# EAGLE design controller (EAGLE 7.7.0)
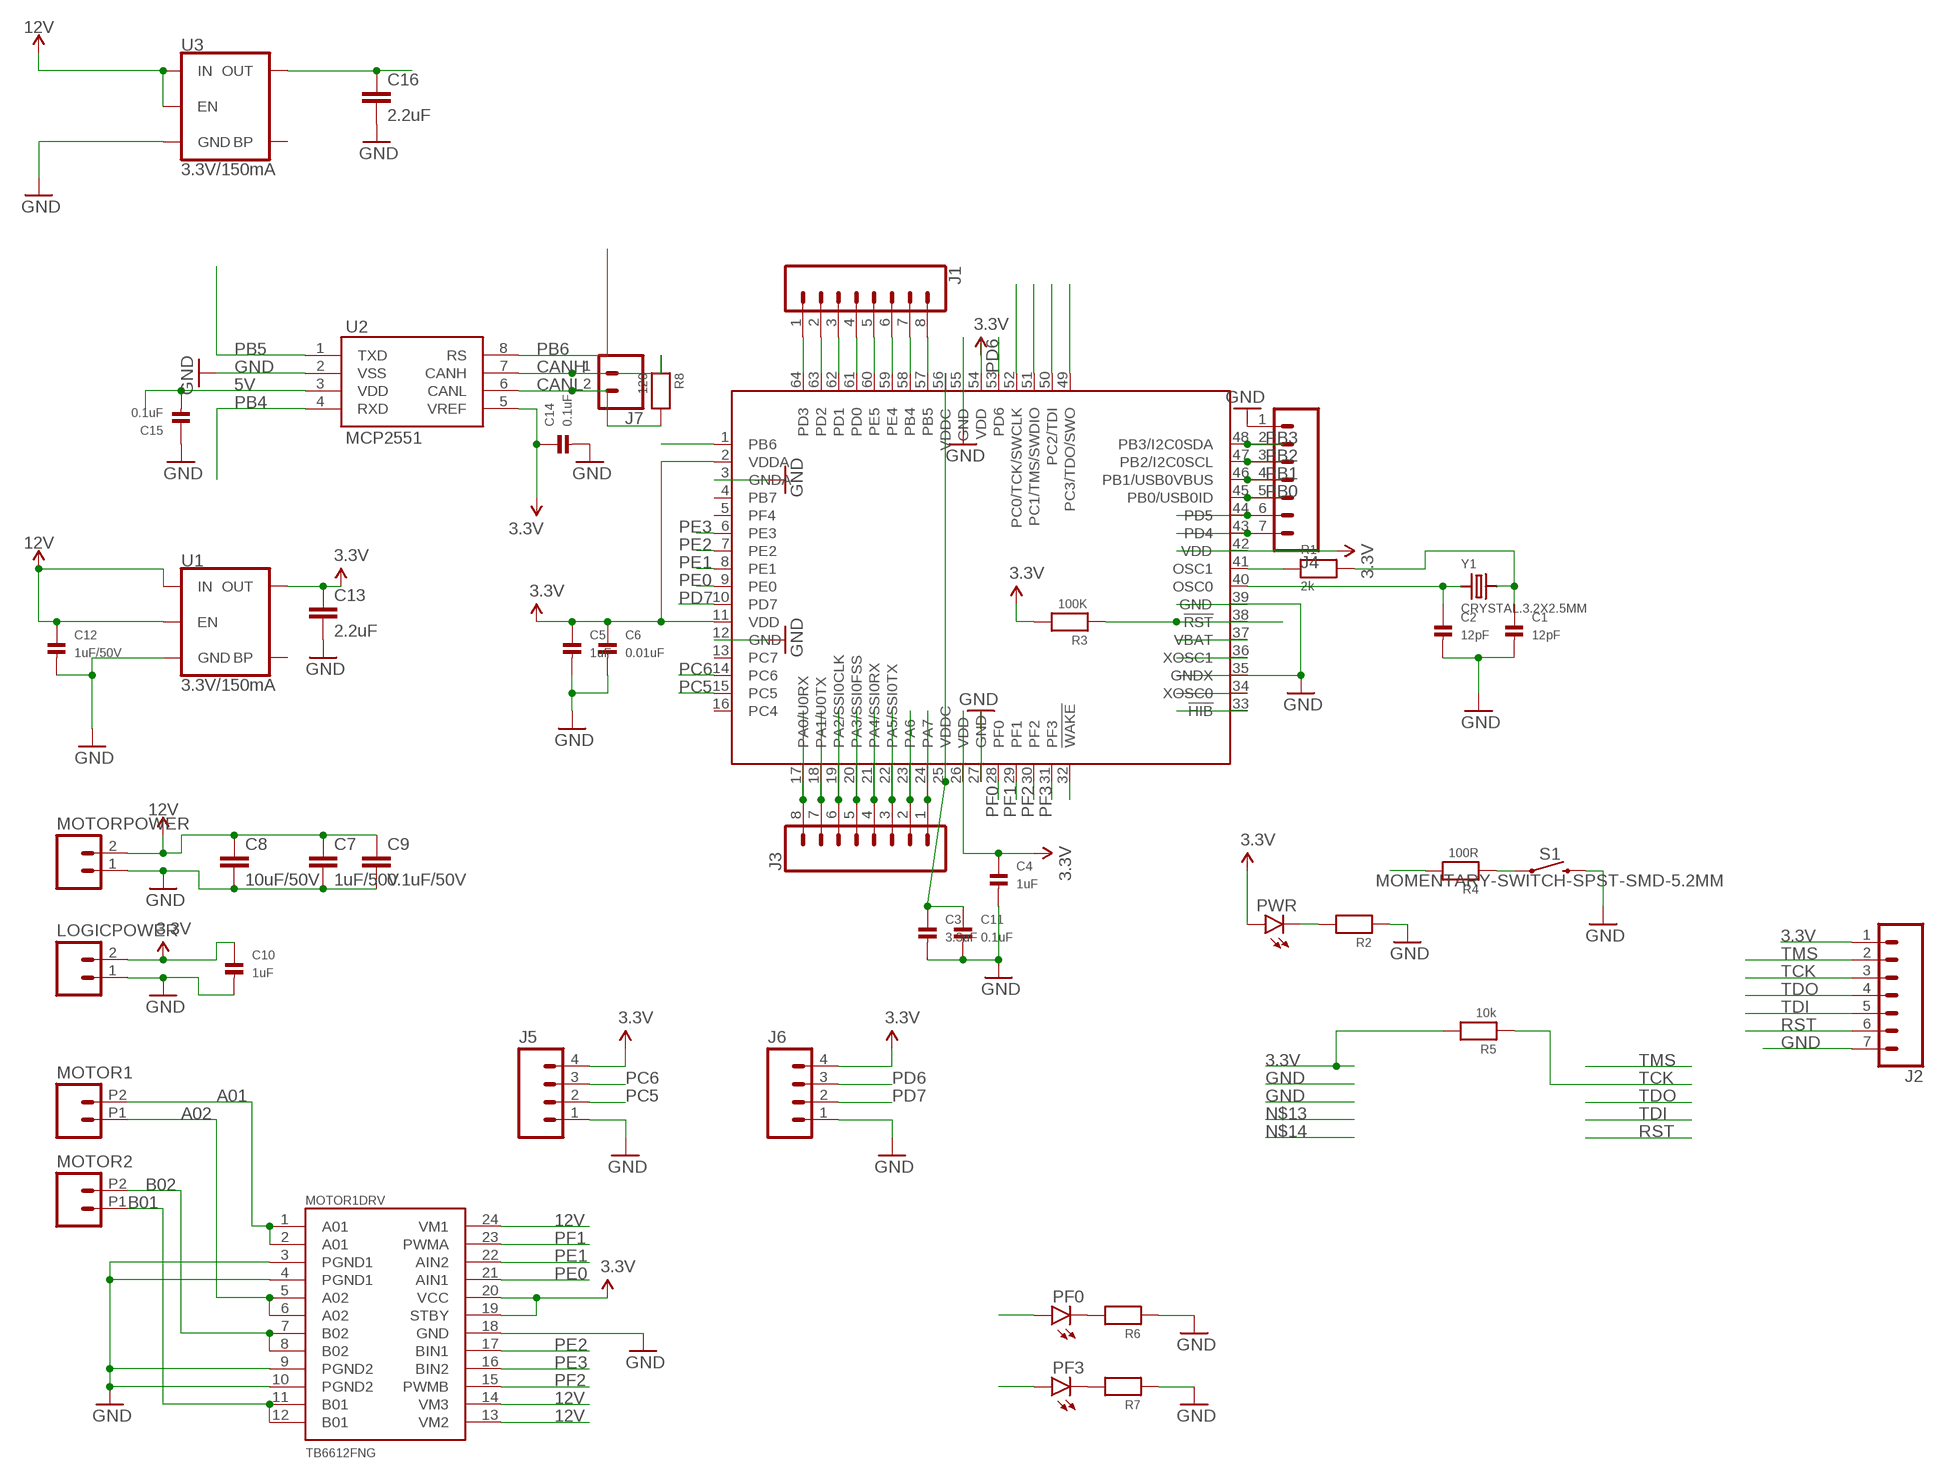
[diagram p0: schematic, sheet 1]

## Parts
C1  12pF  CAP_CERAMIC_0603MP  [_0603MP]
C2  12pF  CAP_CERAMIC_0603MP  [_0603MP]
C3  3.3uF  CAP_CERAMIC_0603MP  [_0603MP]
C4  1uF  CAP_CERAMIC_0603MP  [_0603MP]
C5  1uF  CAP_CERAMIC_0603MP  [_0603MP]
C6  0.01uF  CAP_CERAMIC_0603MP  [_0603MP]
C7  1uF/50V  0.1UF-25V(+80/-20%)(0603)  [0603-CAP]
C8  10uF/50V  1.0UF-25V-+80/-20(0805)"  [0805-CAP]
C9  0.1uF/50V  0.1UF-25V(+80/-20%)(0603)  [0603-CAP]
C10  1uF  CAP_CERAMIC_0603MP  [_0603MP]
C11  0.1uF  CAP_CERAMIC_0603MP  [_0603MP]
C12  1uF/50V  CAP_CERAMIC_0603MP  [_0603MP]
C13  2.2uF  2.2UF-0805-25V-(+80/-20%)  [0805]
C14  0.1uF  CAP_CERAMIC_0603MP  [_0603MP]
C15  0.1uF  CAP_CERAMIC_0603MP  [_0603MP]
C16  2.2uF  2.2UF-0805-25V-(+80/-20%)  [0805]
IC1  TM4C123[7,G]XXPM  [PM_S-PQFP-G64]
J1  CONN_08"  [1X08@1]
J2  CONN_07  [1X07@1]
J3  CONN_08"  [1X08@1]
J4  M07  [1X07]
J5  M04PTH  [1X04]
J6  M04PTH  [1X04]
J7  CONN_02  [1X02]
LOGICPOWER  M02PTH  [1X02@1]
MOTOR1  M022.54MM_SCREWTERM  [1X02_2.54_SCREWTERM@1]
MOTOR1DRV  TB6612FNG  [SSOP24]
MOTOR2  M022.54MM_SCREWTERM  [1X02_2.54_SCREWTERM@1]
MOTORPOWER  M02PTH  [1X02@1]
PF0  LED0603  [LED-0603]
PF3  LED0603  [LED-0603]
PWR  LED0603  [LED-0603]
R1  2k  RESISTOR_0603MP  [_0603MP]
R2  RESISTOR_0603MP  [_0603MP]
R3  100K  RESISTOR_0603MP  [_0603MP]
R4  100R  RESISTOR_0603MP  [_0603MP]
R5  10k  RESISTOR_0603MP  [_0603MP]
R6  RESISTOR_0603MP  [_0603MP]
R7  RESISTOR_0603MP  [_0603MP]
R8  120  RESISTOR_0603MP  [_0603MP]
S1  MOMENTARY-SWITCH-SPST-SMD-5.2MM  [TACTILE_SWITCH_SMD_5.2MM]
U1  3.3V/150mA  V_REG_MIC52053.3V  [SOT23-5]
U2  MCP2551  [SO08]
U3  3.3V/150mA  V_REG_MIC52053.3V  [SOT23-5]
Y1  CRYSTAL.3.2X2.5MM  [3.2X2.5MM]

## Nets
3.3V: C4.1 C5.1 C6.1 C10.1 C13.1 C14.1 IC1.2(VDDA) IC1.11(VDD) IC1.26(VDD) IC1.42(VDD) IC1.54(VDD) J2.1 J5.4 J6.4 LOGICPOWER.2 MOTOR1DRV.19(STBY) MOTOR1DRV.20(VCC) PWR.A R3.2 R5.2 U1.5(OUT) U2.5(VREF)
5V: C15.2 C16.1 U2.3(VDD) U3.5(OUT)
12V: C7.1 C8.1 C9.1 C12.1 MOTOR1DRV.13(VM2) MOTOR1DRV.14(VM3) MOTOR1DRV.24(VM1) MOTORPOWER.2 U1.1(IN) U1.3(EN) U3.1(IN) U3.3(EN)
A01: MOTOR1.P2 MOTOR1DRV.1(A01) MOTOR1DRV.2(A01)
A02: MOTOR1.P1 MOTOR1DRV.5(A02) MOTOR1DRV.6(A02)
B01: MOTOR1DRV.11(B01) MOTOR1DRV.12(B01) MOTOR2.P1
B02: MOTOR1DRV.7(B02) MOTOR1DRV.8(B02) MOTOR2.P2
CANH: J7.1 R8.1 U2.7(CANH)
CANL: J7.2 R8.2 U2.6(CANL)
GND: C1.2 C2.2 C3.2 C4.2 C5.2 C6.2 C7.2 C8.2 C9.2 C10.2 C11.2 C12.2 C13.2 C14.2 C15.1 C16.2 IC1.3(GNDA) IC1.12(GND) IC1.27(GND) IC1.35(GNDX) IC1.39(GND) IC1.55(GND) J2.7 J4.1 J5.1 J6.1 LOGICPOWER.1 MOTOR1DRV.3(PGND1) MOTOR1DRV.4(PGND1) MOTOR1DRV.9(PGND2) MOTOR1DRV.10(PGND2) MOTOR1DRV.18(GND) MOTORPOWER.1 R2.1 R6.1 R7.1 S1.3 U1.2(GND) U2.2(VSS) U3.2(GND)
N$1: IC1.41(OSC1) R1.1
N$2: C2.1 IC1.40(OSC0) Y1.1
N$3: C3.1 C11.1 IC1.25(VDDC) IC1.56(VDDC)
N$4: C1.1 R1.2 Y1.3
N$5: PF0.C R6.2
N$7: PF3.C R7.2
N$19: IC1.64(PD3) J1.1
N$20: IC1.63(PD2) J1.2
N$21: IC1.62(PD1) J1.3
N$22: IC1.61(PD0) J1.4
N$23: IC1.60(PE5) J1.5
N$24: IC1.59(PE4) J1.6
N$28: IC1.32(!WAKE)
N$33: IC1.24(PA7) J3.1
N$34: IC1.23(PA6) J3.2
N$35: IC1.22(PA5/SSI0TX) J3.3
N$36: IC1.21(PA4/SSI0RX) J3.4
N$37: IC1.20(PA3/SSI0FSS) J3.5
N$38: IC1.19(PA2/SSI0CLK) J3.6
N$39: IC1.18(PA1/U0TX) J3.7
N$40: IC1.17(PA0/U0RX) J3.8
N$45: IC1.44(PD5) J4.6
N$46: IC1.43(PD4) J4.7
N$47: IC1.37(VBAT)
N$48: IC1.36(XOSC1)
N$49: IC1.34(XOSC0)
N$50: IC1.33(!HIB)
N$51: PWR.C R2.2
N$52: R4.1 S1.1
PB0: IC1.45(PB0/USB0ID) J4.5
PB1: IC1.46(PB1/USB0VBUS) J4.4
PB2: IC1.47(PB2/I2C0SCL) J4.3
PB3: IC1.48(PB3/I2C0SDA) J4.2
PB4: IC1.58(PB4) J1.7 U2.4(RXD)
PB5: IC1.57(PB5) J1.8 U2.1(TXD)
PB6: IC1.1(PB6) U2.8(RS)
PC5: IC1.15(PC5) J5.2
PC6: IC1.14(PC6) J5.3
PD6: IC1.53(PD6) J6.3
PD7: IC1.10(PD7) J6.2
PE0: IC1.9(PE0) MOTOR1DRV.21(AIN1)
PE1: IC1.8(PE1) MOTOR1DRV.22(AIN2)
PE2: IC1.7(PE2) MOTOR1DRV.17(BIN1)
PE3: IC1.6(PE3) MOTOR1DRV.16(BIN2)
PF0: IC1.28(PF0) PF0.A
PF1: IC1.29(PF1) MOTOR1DRV.23(PWMA)
PF2: IC1.30(PF2) MOTOR1DRV.15(PWMB)
PF3: IC1.31(PF3) PF3.A
RST: IC1.38(!RST) J2.6 R3.1 R4.2
TCK: IC1.52(PC0/TCK/SWCLK) J2.3 R5.1
TDI: IC1.50(PC2/TDI) J2.5
TDO: IC1.49(PC3/TDO/SWO) J2.4
TMS: IC1.51(PC1/TMS/SWDIO) J2.2
Unconnected: IC1.4(PB7) IC1.5(PF4) IC1.13(PC7) IC1.16(PC4) U1.4(BP) U3.4(BP)

## Library data of the parts
C1-C6 C10-C12 C14 C15 = microbuilder:CAP_CERAMIC: Ceramic Capacitors 0402 - 0402 Surface Mount Capacitors 16pF 50V 5% [Digikey: 445-4899-2-ND] 18pF 50V 5% [Digikey: 490-1281-2-ND] 22pF 50V 5% [Digikey: 490-1283-2-ND] 68pF 50V 5% [Digikey: 490-1289-2-ND] 0.1uF 10V 10% [Digikey: 490-1318-2-ND] 1.0uF 6.3V 10% [Digikey: 490-1320-2-ND] 0603 - 0603 Surface Mount Capacitors 16 pF 50V 5% [Digikey: 445-5051-2-ND] 22 pF 50V [Digikey: PCC220ACVTR-ND] 33 pF 50V 5% [Digikey: 490-1415-1-ND] 56pF 50V 5% [Digikey: 490-1421-1-ND] 220pF 50V 5% [Digikey: 445-1285-1-ND] 680 pF 50V 2200 pF 50V 5% C0G [Digikey: 445-1297-1-ND] 5600 pF 100V 5% X7R [Digikey: 478-3711-1-ND] 0.1 µF 25V 10% [Digikey: PCC2277TR-ND] 0.22 µF 16V 10% X7R [Digikey: 445-1318-1-ND] 1.0 µF 25V 10% [Digikey: 445-5146-2-ND] 0603 - RF Specific 3pF 250V +/-0.1pF RF [Digikey: 712-1347-1-ND] 18 pF 250V 5% [Digikey: 478-3505-1-ND or 712-1322-1-ND] 56 pF 250V 5% C0G RF [Digikey: 490-4867-1-ND] 68 pF 250V RF [Digikey: 490-4868-1-ND] 0805 - 0805 Surface Mount Capacitors 220 pF 250V 2% RF Ceramic Capacitor [Digikey: 712-1398-1-ND] 1000 pF 50V 2% NP0 Ceramic Capacitor [Digikey: 478-3760-1-ND] 0.1 µF 25V 10% Ceramic Capacitor [Digikey: PCC1828TR-ND] 1.0 µF 16V 10% Ceramic Capacitor[Digikey: 490-1691-2-ND] 10.0 µF 10V 10% Ceramic Capacitor[Digikey: 709-1228-1-ND] 10.0 uF 16V 10% Ceramic Capacitor [Digikey: 478-5165-2-ND] 47 uF 6.3V 20% Ceramic Capacitor [Digikey: 587-1779-1-ND or 399-5506-1-ND] 1206 - 1206 Surface Mount Capacitors 47uF 10V 20% Ceramic Capacitor [Digikey: 490-5528-1-ND or 399-5508-1-ND or 445-6010-1-ND] 100uF 6.3V -20%, +80% Y5V Ceramic Capacitor (Digikey: 490-4512-1-ND, Mouser: 81-GRM31CF50J107ZE1L)
C7 C9 = SparkFun-Capacitors:0.1UF-25V(+80/-20%)(0603): CAP-00810 Ceramic Standard decoupling cap; PROD_ID: CAP-00810; VALUE: 0.1uF
C8 = SparkFun-Capacitors:1.0UF-25V-+80/-20(0805): CAP-11625; PROD_ID: CAP-11625; VALUE: 1.0uF
C13 C16 = SparkFun-Capacitors:2.2UF: 2.2µF ceramic capacitors A capacitor is a passive two-terminal electrical component used to store electrical energy temporarily in an electric field.; PROD_ID: CAP-11624
IC1 = ti-tiva:TM4C123[7,G]XX
J1 J3 = SparkFun-Connectors:CONN_08: Multi connection point. Often used as Generic Header-pin footprint for 0.1 inch spaced/style header connections On any of the 0.1 inch spaced packages, you can populate with these: Break Away Headers - Straight <https://www.sparkfun.com/products/116> (PRT-00116) Break Away Male Headers - Right Angle <https://www.sparkfun.com/products/553> (PRT-00553) Female Headers <https://www.sparkfun.com/products/115> (PRT-00115) Break Away Headers - Machine Pin <https://www.sparkfun.com/products/117> (PRT-00117) Break Away Female Headers - Swiss Machine Pin <https://www.sparkfun.com/products/743> (PRT-00743) Arduino Stackable Header - 8 Pin <https://www.sparkfun.com/products/9279> (PRT-09279) For SCREWTERMINALS and SPRING TERMINALS visit here: Screw Terimnals on SparkFun.com <https://www.sparkfun.com/search/results?term=Screw+Terminals> (5mm/3.5mm/2.54mm spacing) This device is also useful as a general connection point to wire up your design to another part of your project. Our various solder wires solder well into these plated through hole pads. Hook-Up Wire - Assortment (Stranded, 22 AWG) <https://www.sparkfun.com/products/11375> (PRT-11375) Hook-Up Wire - Assortment (Solid Core, 22 AWG) <https://www.sparkfun.com/products/11367> (PRT-11367) View the entire wire category on our website here <https://www.sparkfun.com/categories/141> Special notes: Molex polarized connector foot print use with SKU : PRT-08231 with associated crimp pins and housings. 1MM SMD Version SKU: PRT-10208 NOTES ON THE VARIANTS LOCK and LOCK_LONGPADS... This footprint was designed to help hold the alignment of a through-hole component (i.e. 6-pin header) while soldering it into place. You may notice that each hole has been shifted either up or down by 0.005 of an inch from it's more standard position (which is a perfectly straight line). This slight alteration caused the pins (the squares in the middle) to touch the edges of the holes. Because they are alternating, it causes a "brace" to hold the component in place. 0.005 has proven to be the perfect amount of "off-center" position when using our standard breakaway headers. Although looks a little odd when you look at the bare footprint, once you have a header in there, the alteration is very hard to notice. Also,if you push a header all the way into place, it is covered up entirely on the bottom side.; PROD_ID: CONN-08438
J2 = SparkFun-Connectors:CONN_07: Multi connection point. Often used as Generic Header-pin footprint for 0.1 inch spaced/style header connections On any of the 0.1 inch spaced packages, you can populate with these: Break Away Headers - Straight <https://www.sparkfun.com/products/116> (PRT-00116) Break Away Male Headers - Right Angle <https://www.sparkfun.com/products/553> (PRT-00553) Female Headers <https://www.sparkfun.com/products/115> (PRT-00115) Break Away Headers - Machine Pin <https://www.sparkfun.com/products/117> (PRT-00117) Break Away Female Headers - Swiss Machine Pin <https://www.sparkfun.com/products/743> (PRT-00743) For SCREWTERMINALS and SPRING TERMINALS visit here: Screw Terimnals on SparkFun.com <https://www.sparkfun.com/search/results?term=Screw+Terminals> (5mm/3.5mm/2.54mm spacing) This device is also useful as a general connection point to wire up your design to another part of your project. Our various solder wires solder well into these plated through hole pads. Hook-Up Wire - Assortment (Stranded, 22 AWG) <https://www.sparkfun.com/products/11375> (PRT-11375) Hook-Up Wire - Assortment (Solid Core, 22 AWG) <https://www.sparkfun.com/products/11367> (PRT-11367) View the entire wire category on our website here <https://www.sparkfun.com/categories/141> Special notes: Molex polarized connector foot print use with SKU : PRT-08231 with associated crimp pins and housings. 1MM SMD Version SKU: PRT-10208 NOTES ON THE VARIANTS LOCK and LOCK_LONGPADS... This footprint was designed to help hold the alignment of a through-hole component (i.e. 6-pin header) while soldering it into place. You may notice that each hole has been shifted either up or down by 0.005 of an inch from it's more standard position (which is a perfectly straight line). This slight alteration caused the pins (the squares in the middle) to touch the edges of the holes. Because they are alternating, it causes a "brace" to hold the component in place. 0.005 has proven to be the perfect amount of "off-center" position when using our standard breakaway headers. Although looks a little odd when you look at the bare footprint, once you have a header in there, the alteration is very hard to notice. Also,if you push a header all the way into place, it is covered up entirely on the bottom side.
J4 = SparkFun-Connectors:M07: Header 7 Standard 7-pin 0.1" header. Use with straight break away headers (SKU : PRT-00116), right angle break away headers (PRT-00553), swiss pins (PRT-00743), machine pins (PRT-00117), and female headers (PRT-00115). NOTES ON THE VARIANTS LOCK and LOCK_LONGPADS... This footprint was designed to help hold the alignment of a through-hole component (i.e. 7-pin header) while soldering it into place. You may notice that each hole has been shifted either up or down by 0.005 of an inch from it's more standard position (which is usually a perfectly straight line). This slight alteration caused the pins (the squares in the middle) to touch the edges of the holes. Because they are alternating, it causes a "brace" to hold the header in place. 0.005 has proven to be the perfect amount of "off-center" position when using our standard breakaway headers. Although looks a little odd when you look at the bare footprint, once you have a header in there, the alteration is very hard to notice. Also, if you push a header all the way into place, it is covered up entirely on the bottom side. This idea of altering the position of holes to aid alignment will be further integrated into the Sparkfun Library for other footprints. It can help hold any component with 3 or more connection pins.
J5 J6 = SparkFun-Connectors:M04: Header 4 Standard 4-pin 0.1" header. Use with straight break away headers (SKU : PRT-00116), right angle break away headers (PRT-00553), swiss pins (PRT-00743), machine pins (PRT-00117), and female headers (PRT-00115). Molex polarized connector foot print use with SKU : PRT-08231 with associated crimp pins and housings. 1MM SMD Version SKU: PRT-10208; PROD_ID: CONN-09696
J7 = SparkFun-Connectors:CONN_02: Multi connection point. Often used as Generic Header-pin footprint for 0.1 inch spaced/style header connections On any of the 0.1 inch spaced packages, you can populate with these: Break Away Headers - Straight <https://www.sparkfun.com/products/116> (PRT-00116) Break Away Male Headers - Right Angle <https://www.sparkfun.com/products/553> (PRT-00553) Female Headers <https://www.sparkfun.com/products/115> (PRT-00115) Break Away Headers - Machine Pin <https://www.sparkfun.com/products/117> (PRT-00117) Break Away Female Headers - Swiss Machine Pin <https://www.sparkfun.com/products/743> (PRT-00743) For SCREWTERMINALS and SPRING TERMINALS visit here: Screw Terimnals on SparkFun.com <https://www.sparkfun.com/search/results?term=Screw+Terminals> (5mm/3.5mm/2.54mm spacing) This device is also useful as a general connection point to wire up your design to another part of your project. Our various solder wires solder well into these plated through hole pads. Hook-Up Wire - Assortment (Stranded, 22 AWG) <https://www.sparkfun.com/products/11375> (PRT-11375) Hook-Up Wire - Assortment (Solid Core, 22 AWG) <https://www.sparkfun.com/products/11367> (PRT-11367) View the entire wire category on our website here <https://www.sparkfun.com/categories/141> Special notes: Molex polarized connector foot print use with: PRT-08233 with associated crimp pins and housings. 2.54_SCREWTERM for use with PRT-10571. 3.5mm Screw Terminal footprints for PRT-08084 5mm Screw Terminal footprints for use with PRT-08432
LOGICPOWER MOTOR1 MOTOR2 MOTORPOWER = SparkFun-Connectors:M02: Standard 2-pin 0.1" header. Use with - straight break away headers ( PRT-00116) - right angle break away headers (PRT-00553) - swiss pins (PRT-00743) - machine pins (PRT-00117) - female headers (PRT-00115) Molex polarized connector foot print use with: PRT-08233 with associated crimp pins and housings. 2.54_SCREWTERM for use with PRT-10571. 3.5mm Screw Terminal footprints for PRT-08084 5mm Screw Terminal footprints for use with PRT-08432
MOTOR1DRV = SparkFun-IC-Special-Function:TB6612FNG: Toshiba 1A dual motor driver IC-09363; PROD_ID: IC-09363
PF0 PF3 PWR = Ilya_Teach:LED: LEDs Standard schematic elements and footprints for 5mm, 3mm, 1206, and 0603 sized LEDs. 5mm - Spark Fun Electronics SKU : COM-00529 (and others)
R1-R8 = microbuilder:RESISTOR: Resistors 0402 - 0402 Surface Mount Package 22 Ohm 1% 1/16W [Digikey: 311-22.0LRTR-ND] 33 Ohm 5% 1/16W 1.0K 5% 1/16W 1.5K 5% 1/16W 2.0K 1% 1/16W 10.0K 1% 1/16W [Digikey: 311-10.0KLRTR-ND] 10.0K 5% 1/16W [Digikey: RMCF0402JT10K0TR-ND] 12.1K 1% 1/16W [Digikey: 311-22.0LRTR-ND] 100.0K 5% 1/16W 0603 - 0603 Surface Mount Package 0 Ohm 1/10 Watt 1% Resistor 15 Ohm 1/10 Watt 1% Resistor 33 Ohm 1/10 Watt 1% Resistor 49.9 Ohm 1/10 Watt 1% Resistor 100 Ohm 1/10 Watt 1% Resistor 150 Ohm 1/10 Watt 1% Resistor 240 Ohm 1/10 Watt 1% Resistor 390 Ohm 1/10 Watt 1% Resistor 560 Ohm 1/10 Watt 1% Resistor 680 Ohm 1/10 Watt 1% Resistor 750 Ohm 1/10 Watt 1% Resistor 1.0K Ohm 1/10 Watt 1% Resistor 1.5K Ohm 1/10 Watt 1% Resistor 2.0K Ohm 1/10 Watt 1% Resistor 2.2K Ohm 1/10 Watt 1% Resistor 3.3K Ohm 1/10 Watt 1% Resistor 4.7K Ohm 1/10 Watt 1% Resistor 10.0K Ohm 1/10 Watt 1% Resistor 12.0K Ohm 1/10 Watt 1% Resistor 12.1K Ohm 1/10 Watt 1% Resistor 20.0K Ohm 1/10 Watt 1% Resistor 33.0K Ohm 1/10 Watt 1% Resistor 100.0K Ohm 1/10 Watt 1% Resistor 0805 - 0805 Surface Mount Package 0 Ohm 1/8 Watt 1% Resistor 33 Ohm 1/8 Watt 1% Resistor 100 Ohm 1/8 Watt 1% Resistor 150 Ohm 1/8 Watt 1% Resistor 200 Ohm 1/8 Watt 1% Resistor 240 Ohm 1/8 Watt 1% Resistor 330 Ohm 1/8 Watt 1% Resistor 390 Ohm 1/8 Watt 1% Resistor 470 Ohm 1/8 Watt 1% Resistor 1.0K Ohm 1/8 Watt 1% Resistor 1.5K Ohm 1/8 Watt 1% Resistor 2.0K Ohm 1/8 Watt 1% Resistor 4.7K Ohm 1/8 Watt 1% Resistor 5.1K Ohm 1/8 Watt 1% Resistor 5.6K Ohm 1/8 Watt 1% Resistor 10.0K Ohm 1/8 Watt 1% Resistor 22.0K Ohm 1/8 Watt 1% Resistor 33.0K Ohm 1/8 Watt 1% Resistor 100K Ohm 1/8 Watt 1% Resistor 1206 - 1206 Surface Mount Package 2012 - 2010 Surface Mount Package 0.11 Ohm 1/2 Watt 1% Resistor - Digikey: RHM.11UCT-ND
S1 = SparkFun-Switches:MOMENTARY-SWITCH-SPST: Momentary Switch (Pushbutton) - SPST Normally-open (NO) SPST momentary switches (buttons, pushbuttons). Variants PTH-12MM - 12mm square, through-hole Momentary Pushbutton Switch - 12mm Square <https://www.sparkfun.com/products/9190> (COM-09190) PTH-6.0MM, PTH-6.0MM-KIT - 6.0mm square, through-hole Mini Pushbutton Switch <https://www.sparkfun.com/products/97> (COM-00097) KIT package intended for soldering kit's - only one side of pads' copper is exposed. PTH-RIGHT-ANGLE-KIT - Right-angle, through-hole Right Angle Tactile Button <https://www.sparkfun.com/products/10791> - Used on SparkFun BigTime Watch Kit <https://www.sparkfun.com/products/11734> SMD-12MM - 12mm square, surface-mount Tactile Button - SMD (12mm) <https://www.sparkfun.com/products/12993> (COM-12993) Used on SparkFun PicoBoard <https://www.sparkfun.com/products/11888> SMD-4.5MM - 4.5mm Square Trackball Switch Used on SparkFun Blackberry Trackballer Breakout <https://www.sparkfun.com/products/13169> SMD-4.6MMX2.8MM - 4.60mm x 2.80mm, surface mount Used on SparkFun SAMD21 Mini Breakout <https://www.sparkfun.com/products/13664> SMD-5.2MM, SMD-5.2-REDUNDANT - 5.2mm square, surface-mount Mini Pushbutton Switch - SMD <https://www.sparkfun.com/products/8720> (COM-08720) Used on Arduino Pro Mini <https://www.sparkfun.com/products/11114> REDUNDANT package connects both switch circuits together SMD-6.0X3.5MM - 6.0 x 3.5mm, surface mount Momentary Reset Switch SMD <https://www.sparkfun.com/products/8229> (COM-08229) SMD-6.2MM-TALL - 6.2mm square, surface mount Tactile Button - SMD (6mm) <https://www.sparkfun.com/products/12992> Used on SparkFun Digital Sandbox <https://www.sparkfun.com/products/12651> SMD-RIGHT-ANGLE - Right-angle, surface mount Used on SparkFun Block for Intel® Edison - Arduino <https://www.sparkfun.com/products/13036>; PROD_ID: SWCH-08247; SF_SKU: COM-08720
U1 U3 = SparkFun-IC-Power:V_REG_MIC5205: V_REG MIC5205 Standard 3.3V, 5V, and Adjustable 150mA LDO voltage regulator in SOT-23 layout. Micrel part MIC5205. BP (by-pass) pin is used to lower output noise with 470pF cap, may be left open. On the adjustable version BP is used to set output.; PROD_ID: VREG-00822
U2 = SparkFun-IC-Comms:MCP2551: MCP2551 High Speed CAN Transceiver High speed CAN transceiver Datasheet <http://www.sparkfun.com/datasheets/DevTools/Arduino/MCP2551.pdf> SparkFun Products CAN-BUS Shield <https://www.sparkfun.com/products/13262> (DEV-13262) SparkFun OBD-II UART <https://www.sparkfun.com/products/9555> (WIG-09555); PROD_ID: IC-09907
Y1 = genLib:CRYSTAL

## Board
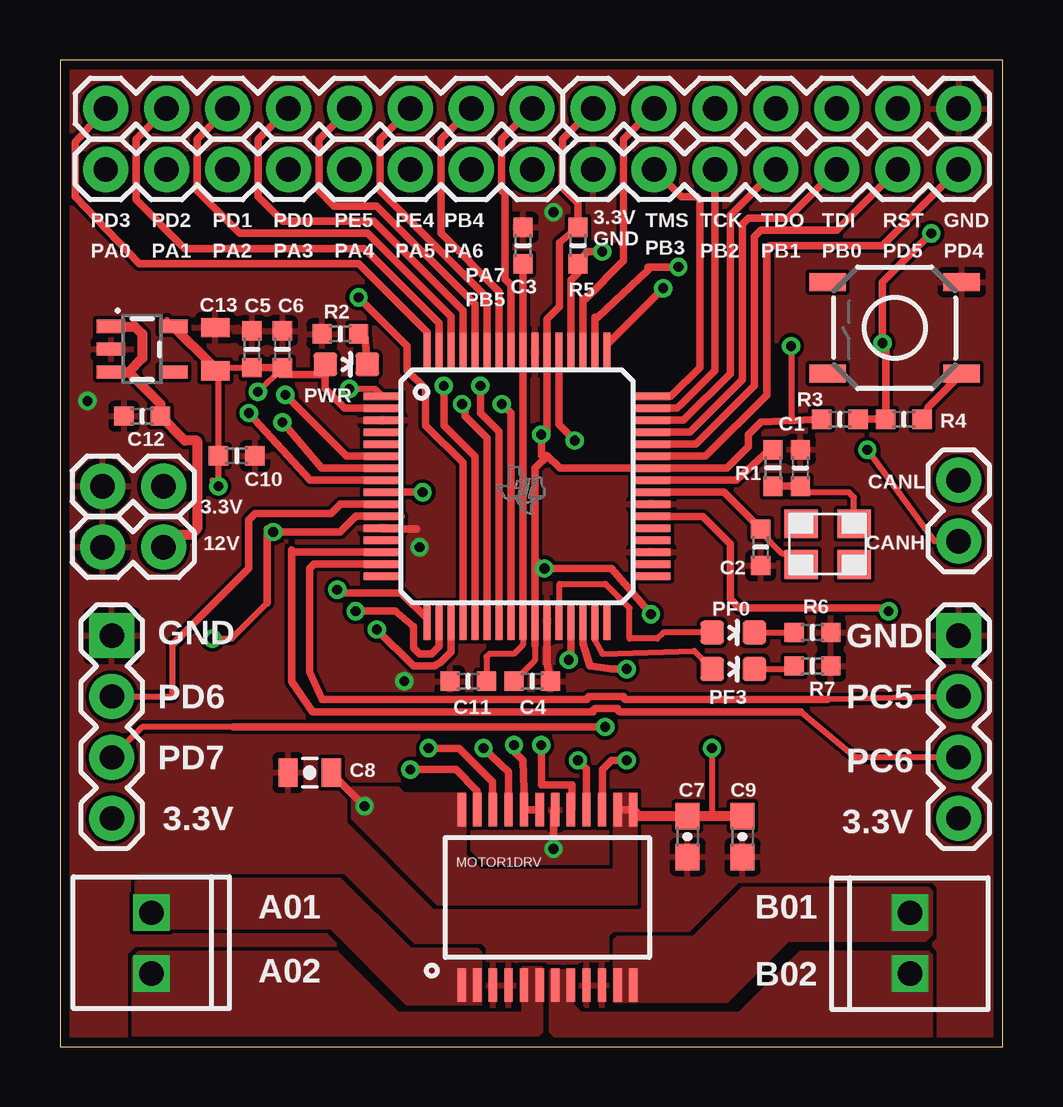
[diagram p1: board, top side]
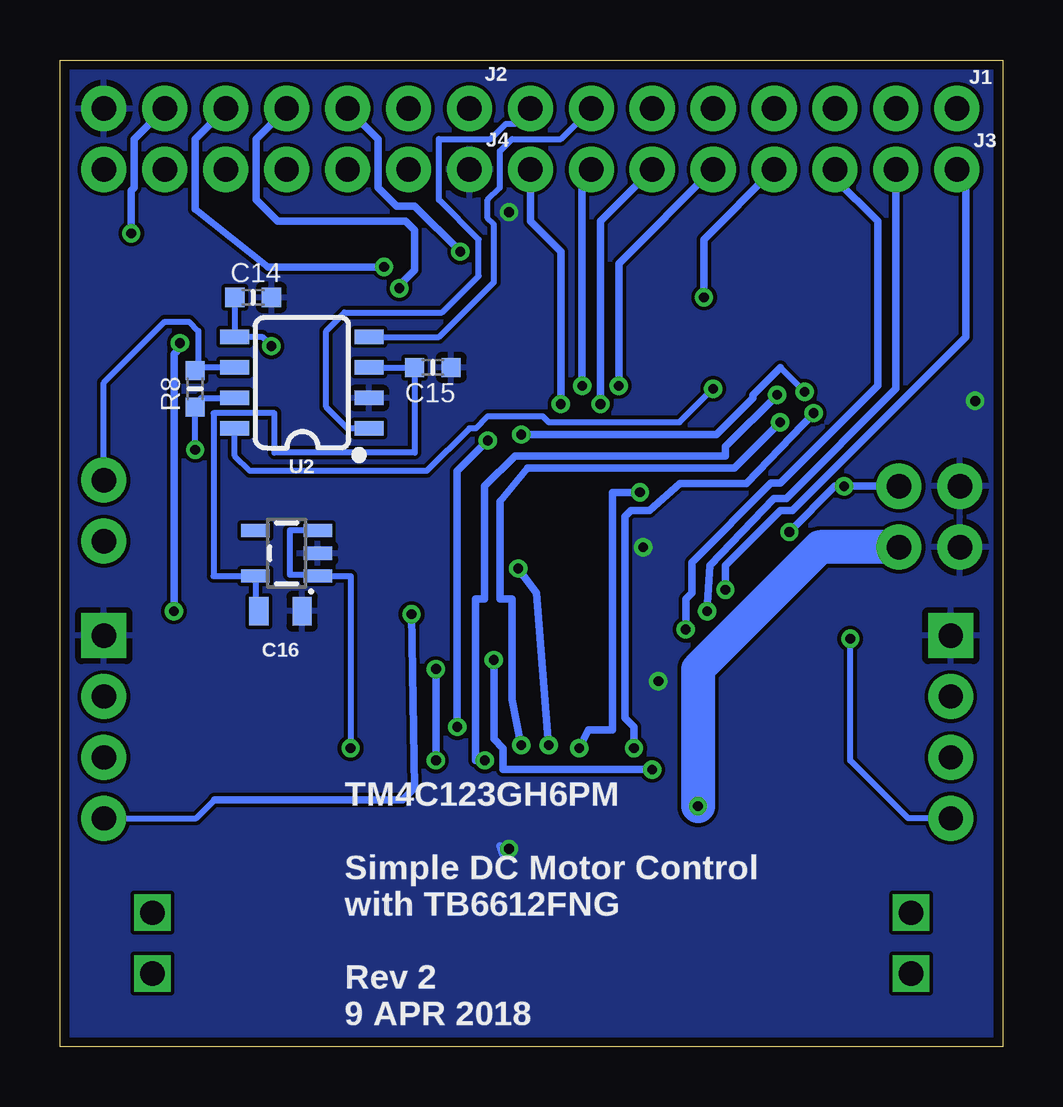
[diagram p2: board, bottom side, seen from below]

Size 39.29 x 41.14 mm. Coordinates in mm from the lower left corner, seen from the top.
Outline: 0,0 39.29,0 39.29,41.14 0,41.14 0,0
Copper layers (1*16): Top 0.0356mm / dielectric 1.5011mm / Bottom 0.0356mm
Design rules "LaenPCBOrder *": minimum track width 6mil, minimum drill 13mil, track to track 6mil, track to pad 6mil, pad to pad 6mil, via to via 6mil, smd to smd 6mil, copper to edge 15mil, drill to drill 6mil, minimum pad ring 7mil, minimum via ring 7mil, stop-mask expansion 3mil, vias tented up to drill 30mil, thermal gap 10mil

### Footprints (pad centres in the part's own frame; a part is rotated, then mirrored left to right if it is on the bottom)
_0603MP = smd 0.8 x 0.8: 1 -0.762,0; 2 0.762,0
0603-CAP = smd 1.1 x 1: 1 -0.85,0; 2 0.85,0
0805-CAP = smd 0.8 x 1.2: 1 -0.9,0; 2 0.9,0
0805 = smd 0.8 x 1.2: 1 -0.9,0; 2 0.9,0
PM_S-PQFP-G64 = smd 1.6 x 0.3: 1 -5.6,3.75; 2 -5.6,3.25; 3 -5.6,2.75; 4 -5.6,2.25; 5 -5.6,1.75; 6 -5.6,1.25; 7 -5.6,0.75; 8 -5.6,0.25; 9 -5.6,-0.25; 10 -5.6,-0.75; 11 -5.6,-1.25; 12 -5.6,-1.75; 13 -5.6,-2.25; 14 -5.6,-2.75; 15 -5.6,-3.25; 16 -5.6,-3.75; 33 5.6,-3.75; 34 5.6,-3.25; 35 5.6,-2.75; 36 5.6,-2.25; 37 5.6,-1.75; 38 5.6,-1.25; 39 5.6,-0.75; 40 5.6,-0.25; 41 5.6,0.25; 42 5.6,0.75; 43 5.6,1.25; 44 5.6,1.75; 45 5.6,2.25; 46 5.6,2.75; 47 5.6,3.25; 48 5.6,3.75 | smd 0.3 x 1.6: 17 -3.75,-5.6; 18 -3.25,-5.6; 19 -2.75,-5.6; 20 -2.25,-5.6; 21 -1.75,-5.6; 22 -1.25,-5.6; 23 -0.75,-5.6; 24 -0.25,-5.6; 25 0.25,-5.6; 26 0.75,-5.6; 27 1.25,-5.6; 28 1.75,-5.6; 29 2.25,-5.6; 30 2.75,-5.6; 31 3.25,-5.6; 32 3.75,-5.6; 49 3.75,5.6; 50 3.25,5.6; 51 2.75,5.6; 52 2.25,5.6; 53 1.75,5.6; 54 1.25,5.6; 55 0.75,5.6; 56 0.25,5.6; 57 -0.25,5.6; 58 -0.75,5.6; 59 -1.25,5.6; 60 -1.75,5.6; 61 -2.25,5.6; 62 -2.75,5.6; 63 -3.25,5.6; 64 -3.75,5.6
1X08@1 = drill 1.016 pad 1.88: 1 0,0; 2 2.54,0; 3 5.08,0; 4 7.62,0; 5 10.16,0; 6 12.7,0; 7 15.24,0; 8 17.78,0
1X07@1 = drill 1.016 pad 1.88: 1 0,0; 2 2.54,0; 3 5.08,0; 4 7.62,0; 5 10.16,0; 6 12.7,0; 7 15.24,0
1X07 = drill 1.016 pad 1.88: 1 0,0; 2 2.54,0; 3 5.08,0; 4 7.62,0; 5 10.16,0; 6 12.7,0; 7 15.24,0
1X04 = drill 1.016 pad 1.88 square: 1 0,0 | drill 1.016 pad 1.88: 2 2.54,0; 3 5.08,0; 4 7.62,0
1X02 = drill 1.016 pad 1.88: 1 0,0; 2 2.54,0
1X02@1 = drill 1.016 pad 1.88: 1 0,0; 2 2.54,0
1X02_2.54_SCREWTERM@1 = drill 1.016 square: P1 2.54,0; P2 0,0
SSOP24 = smd 0.348 x 1.397: 1 -3.575,-3.656; 2 -2.925,-3.656; 3 -2.275,-3.656; 4 -1.625,-3.656; 5 -0.975,-3.656; 6 -0.325,-3.656; 7 0.325,-3.656; 8 0.975,-3.656; 9 1.625,-3.656; 10 2.275,-3.656; 11 2.925,-3.656; 12 3.575,-3.656; 13 3.575,3.656; 14 2.925,3.656; 15 2.275,3.656; 16 1.625,3.656; 17 0.975,3.656; 18 0.325,3.656; 19 -0.325,3.656; 20 -0.975,3.656; 21 -1.625,3.656; 22 -2.275,3.656; 23 -2.925,3.656; 24 -3.575,3.656
LED-0603 = smd 1 x 1: A 0,-0.877; C 0,0.877
TACTILE_SWITCH_SMD_5.2MM = smd 1.524 x 0.762: 1 -2.794,1.905; 2 2.794,1.905; 3 -2.794,-1.905; 4 2.794,-1.905
SOT23-5 = smd 0.55 x 1.2: 1 -0.95,-1.3; 2 0,-1.3; 3 0.95,-1.3; 4 0.95,1.3; 5 -0.95,1.3
SO08 = smd 0.6 x 1.2: 1 -1.905,-2.8; 2 -0.635,-2.8; 3 0.635,-2.8; 4 1.905,-2.8; 5 1.905,2.8; 6 0.635,2.8; 7 -0.635,2.8; 8 -1.905,2.8
3.2X2.5MM = smd 1.4 x 1.2: 1 -1.1,-0.85; 2 1.1,-0.85; 3 1.1,0.85; 4 -1.1,0.85

### Placement (x,y rotation side)
C1  30.86,24.13 90 top
C2  29.21,20.83 270 top
C3  19.3,33.4 90 top
C4  19.69,15.24 0 top
C5  8,29.08 90 top
C6  9.27,29.08 90 top
C7  26.16,8.76 270 top
C8  10.41,11.43 180 top
C9  28.45,8.76 270 top
C10  7.37,24.64 0 top
C11  17.02,15.24 180 top
C12  3.43,26.29 180 top
C13  6.48,29.08 90 top
C14  31.24,31.24 0 bottom
C15  23.75,28.32 180 bottom
C16  30.1,18.16 0 bottom
IC1  19.05,23.37 0 top
J1  1.91,39.12 0 top
J2  22.23,39.12 0 top
J3  19.69,36.58 180 top
J4  22.23,36.58 0 top
J5  37.47,17.14 270 top
J6  2.16,17.14 270 top
J7  37.47,21.08 90 top
LOGICPOWER  1.78,23.37 0 top
MOTOR1  3.81,5.59 270 top
MOTOR1DRV  20.32,6.22 0 top
MOTOR2  35.43,3.05 90 top
MOTORPOWER  1.78,20.83 0 top
PF0  28.07,17.27 270 top
PF3  28.07,15.75 270 top
PWR  11.94,28.45 270 top
R1  29.72,24.13 270 top
R2  11.68,29.72 0 top
R3  32.51,26.16 180 top
R4  35.18,26.16 180 top
R5  21.59,33.4 90 top
R6  31.37,17.27 180 top
R7  31.37,15.88 180 top
R8  33.66,27.43 90 bottom
S1  34.8,29.97 180 top
U1  3.43,29.08 270 top
U2  29.21,27.69 90 bottom
U3  29.84,20.57 90 bottom
Y1  32,20.96 0 top

### Tracks (layer width: path | path; a pad name or v marks a point on that pad's centre or on a via)
3.3V  (via drill 0.41)
  Top 0.254: v6.35,17.02 7.16,17.02 8.64,18.49 | 19.8,16.75 19.8,16.12 C4.1 | C6.1 v8.25,27.3 | 6.35,23.62 v6.6,23.37 C10.1 6.6,28.19 | 8.13,28.19 C5.1 6.6,28.32 6.6,28.19 | 4.46,30.31 U1.5 | 6.6,28.19 6.59,28.18 C13.1 6.35,28.32 | v30.48,29.21 30.48,26.11 30.61,26.11
  Top 0.305: 19.8,16.75 IC1.26 19.8,20.32 | C5.1 C6.1 9.2,28.02 10.98,28.02 PWR.A 11.05,28.31 11.05,27.43 11.86,26.62 IC1.2 | 20.32,24.64 20.3,24.66 20.07,24.66 v20.07,25.53 20.3,25.65 IC1.54 20.3,30.33 20.83,30.86 20.83,33.53 R5.2 21.59,35.18 20.96,35.81 20.96,37.85 J2.1 | 20.32,24.64 20.84,24.12 IC1.42 27.8,24.12 28.7,25.02 28.7,25.53 29.21,26.04 30.61,26.11 R3.2 | 19.8,20.32 19.8,24.12 20.32,24.64 | v18.92,12.57 18.92,12.32 19.3,11.94 19.35,10.71 MOTOR1DRV.20 MOTOR1DRV.19 | 19.8,20.32 20.31,19.81 v20.19,19.94 22.99,19.94 v24.64,18.03 | 8.64,18.49 8.64,21.59 v8.89,21.46 11.68,21.46 12.34,22.12 IC1.11 13.47,22.1 14.22,22.1
  Top 0.406: 6.35,28.32 6.35,28.41 U1.5
  Bottom 0.254: v6.35,17.02 6.35,11.94 3.94,9.52 J6.4 | J5.4 33.61,9.52 32.84,10.29 | v8.25,27.3 C6.1 | C14.1 U2.5 | U2.5 | U2.5 30.87,29.6 v30.48,29.21
  Bottom 0.305: v18.92,12.57 19.43,18.92 v20.19,19.94 | v8.89,21.46 6.99,23.37 v6.6,23.37 LOGICPOWER.2 | v20.07,25.53 11.94,25.53 10.41,27.05 10.41,27.18 C6.1 | v24.64,18.03 24.51,10.8 25.02,10.29 32.84,10.29
5V
  Bottom 0.254: U2.3 C15.2 24.51,24.77 30.35,24.77 30.35,26.42 32.89,26.42 32.89,19.62 U3.5 31.15,18.16 C16.1
12V  (via drill 0.41)
  Top 0.254: 11.23,11.51 11.24,11.51 C8.1 | v27.18,12.45 27.18,9.61
  Top 0.305: MOTOR1DRV.14 MOTOR1DRV.13 24.11,9.66 | 11.23,11.51 v12.7,10.03
  Top 0.406: U1.3 2.85,28.13 | MOTORPOWER.2 4.83,21.34 5.46,21.34 5.72,21.59 5.72,25.27 5.21,25.27 C12.1 4.19,26.8 2.85,28.13 | U1.1 3.11,30.03 3.43,29.72 3.43,28.71 2.85,28.13 | MOTOR1DRV.13 24.16,9.61 C7.1 27.18,9.61 C9.1
  Bottom 0.254: U3.3 29.72,21.52 29.72,19.69 28.55,19.69 U3.1 27.18,19.62 v27.18,12.45
  Bottom 1.422: MOTORPOWER.2 7.62,20.83 12.7,15.75 v12.7,10.03
  pour Top (no thermals): 12.19,10.8 14.1,10.8 14.35,10.54 16.89,10.54 16.89,8 17.53,7.37 23.11,7.37 23.11,10.54 24,10.54 24,5.97 16.38,5.97 15.75,5.97 12.19,9.52
A01
  pour Top (isolate 0.254, rank 2, no thermals): 3.43,6.99 11.68,6.99 14.61,4.06 17.4,4.06 17.53,3.94 17.53,1.78 14.48,1.78 11.3,4.95 3.3,4.95 3.17,5.08 3.17,6.86 3.3,6.86
A02
  pour Top (no thermals): 3.3,3.94 11.56,3.94 14.1,1.4 19.3,1.4 19.3,3.3 20.07,3.3 20.07,0.63 19.94,0.51 3.05,0.51 3.05,3.68
B01
  pour Top (no thermals): 23.11,1.91 23.11,4.44 23.24,4.57 26.42,4.57 28.45,6.6 36.2,6.6 36.32,6.48 36.32,4.7 36.07,4.44 30.35,4.44 27.81,1.91
B02
  pour Top (no thermals): 20.45,3.17 20.45,0.63 20.7,0.38 36.32,0.38 36.32,3.81 36.2,3.94 30.86,3.94 28.32,1.4 21.72,1.4 21.34,1.78 21.34,3.17
CANH  (via drill 0.41)
  Top 0.254: J7.1 36.45,21.08 v33.66,24.89
  Bottom 0.254: U2.7 33.41,27.05 R8.1 v33.66,24.89
CANL
  Bottom 0.254: U2.6 33.53,28.32 | J7.2 37.47,27.69 34.93,30.23 33.91,30.23 33.53,29.85 33.53,28.32 | 33.53,28.32 R8.2
GND  (via drill 0.41)
  Top 0.305: MOTOR1DRV.18 20.57,9.81 v20.57,8.25 | IC1.12 13.48,21.59 14.86,21.59 | IC1.27 20.3,15.98 C4.2
  Bottom 0.305: v20.57,8.25 20.83,8 20.96,8.38
  other vias: 14.99,20.83 20.57,34.8 14.35,15.24 1.14,26.92
  pour Bottom (rank 6): -2.54,43.69 40.64,43.69 40.64,-4.57 -2.54,-4.57
  pour Top (rank 3): -2.54,43.69 40.64,43.69 40.64,-4.57 -2.54,-4.57
N$1
  Top 0.305: IC1.41 28.19,23.62 29.59,24.89 R1.1
N$2
  Top 0.254: C2.1 29.21,21.46 30.1,20.57 30.44,20.57 Y1.1
  Top 0.305: C2.1 27.68,23.12 IC1.40
N$3
  Top 0.254: IC1.25 19.3,16.76 18.92,16.38 17.91,16.38 17.78,16.26 C11.1
  Top 0.305: C3.1 19.3,32.52 IC1.56 IC1.25
N$4
  Top 0.254: Y1.3 33.1,22.9 32.89,23.11 31.12,23.11 C1.1
  Top 0.305: R1.2 C1.1
N$5
  Top 0.254: PF0.C R6.2
N$7
  Top 0.254: PF3.C 30.61,15.75 R7.2
N$19
  Top 0.305: IC1.64 15.3,29.79 12.45,32.64 3.3,32.64 0.63,35.43 0.63,37.72 J1.1
N$20
  Top 0.305: IC1.63 15.8,30.17 12.7,33.27 5.21,33.27 3.17,35.31 3.17,37.85 J1.2
N$21
  Top 0.305: IC1.62 16.3,30.44 12.83,33.91 7.49,33.91 5.72,35.69 5.72,37.85 J1.3
N$22
  Top 0.305: IC1.61 16.8,30.7 13.08,34.42 9.27,34.42 8.25,35.43 8.25,37.85 J1.4
N$23
  Top 0.305: IC1.60 17.3,30.96 13.21,35.05 11.43,35.05 10.8,35.69 10.8,37.85 J1.5
N$24
  Top 0.305: IC1.59 17.8,31.22 13.34,35.69 13.34,37.85 J1.6
N$33  (via drill 0.41)
  Top 0.305: IC1.24 18.8,26.41 v18.41,26.8
  Bottom 0.305: v18.41,26.8 18.41,33.15 19.69,34.42 J3.1
N$34  (via drill 0.41)
  Top 0.305: IC1.23 18.3,25.64 17.53,26.42 v17.53,27.56
  Bottom 0.305: v17.53,27.56 17.53,36.2 J3.2
N$35  (via drill 0.41)
  Top 0.305: IC1.22 17.8,25.38 16.89,26.29 16.89,26.8 v16.76,26.8
  Bottom 0.305: v16.76,26.8 16.76,34.42 J3.3
N$36  (via drill 0.41)
  Top 0.305: IC1.21 17.3,24.61 16,25.91 v16,27.56
  Bottom 0.305: v16,27.56 16,32.64 J3.4
N$37  (via drill 0.41)
  Top 0.305: IC1.20 16.8,24.35 15.24,25.91 15.24,27.43 14.48,28.19 14.48,29.21 v12.45,31.24
  Bottom 0.305: v12.45,31.24 12.45,33.65 J3.5
N$38  (via drill 0.41)
  Top 0.305: v13.21,17.4 14.73,15.88 15.62,15.88 15.88,16.04 16.3,16.47 IC1.19
  Bottom 0.305: J3.6 6.99,36.2 5.21,34.42 5.21,27.56 9.27,23.5 9.65,23.5 12.95,20.19 12.95,18.92 13.21,18.67 v13.21,17.4
N$39  (via drill 0.41)
  Top 0.305: IC1.18 15.8,16.69 15.49,16.38 14.99,16.38 14.73,16.64 14.73,17.53 13.97,18.16 v12.32,18.16
  Bottom 0.305: v12.32,18.16 12.19,20.07 9.52,22.86 9.02,22.86 4.45,27.43 J3.7
N$40  (via drill 0.41)
  Top 0.305: IC1.17 15.3,17.85 14.22,18.92 11.68,18.92 v11.56,19.05
  Bottom 0.305: v11.56,19.05 11.56,20.07 9.27,22.35 8.76,22.35 1.52,29.59 1.52,36.2 J3.8
N$45
  Top 0.305: IC1.44 26.52,25.12 28.96,27.56 28.96,33.78 29.21,34.04 32.38,34.04 J4.6
N$46
  Top 0.305: IC1.43 26.9,24.62 29.46,27.18 29.46,33.27 29.59,33.4 34.29,33.4 J4.7
N$51
  Top 0.305: R2.2 12.69,29.71 PWR.C
N$52
  Top 0.305: 37.08,27.69 S1.1 36.2,26.67 R4.1
PB0
  Top 0.305: IC1.45 26.25,25.62 28.45,27.81 28.45,34.29 28.7,34.54 30.35,34.54 J4.5
PB1
  Top 0.305: IC1.46 25.99,26.12 27.94,28.07 27.94,34.67 J4.4
PB2
  Top 0.305: J4.3 27.3,28.19 25.97,26.86 25.91,26.8 25.73,26.62 IC1.47
PB3
  Top 0.305: IC1.48 25.47,27.12 26.67,28.32 26.67,35.31 26.54,35.43 25.91,35.43 J4.2
PB4
  Top 0.305: IC1.58 18.3,31.48 15.88,33.91 15.88,37.85 J1.7
  Bottom 0.254: U2.4 23.5,29.59 21.21,31.88 21.21,34.29 21.46,34.54 21.46,35.31 20.96,35.81 20.96,37.34 20.45,37.85 18.41,37.85 J1.7
PB5
  Top 0.305: IC1.57 18.8,31.75 18.54,32 18.54,35.56 18.41,35.69 18.41,37.85 J1.8
  Bottom 0.254: U2.1 27.3,25.78 28.19,26.67 28.19,29.85 27.43,30.61 23.37,30.61 21.84,32.13 21.84,33.65 23.5,35.31 23.5,37.85 21.34,37.85 20.7,38.48 20.32,38.48 J1.8
PB6  (via drill 0.41)
  Top 0.254: v12.07,27.43 13.14,27.43 IC1.1
  Bottom 0.254: v12.07,27.43 13.46,26.04 18.92,26.04 19.18,26.29 21.46,26.29 21.97,25.78 22.23,25.78 24,24 31.37,24 32,24.64 U2.8
PC5
  Top 0.254: J5.2 31.99,14.48
  Top 0.305: 31.99,14.48 23.62,14.48 arc-90 23.5,14.61 22.1,14.61 arc90 21.97,14.48 10.92,14.48 10.41,15.62 10.41,19.94 10.59,20.12 IC1.15
PC6
  Top 0.254: J5.3 33.16,12.07 30.88,13.97
  Top 0.305: 30.88,13.97 23.37,13.97 arc-90 23.24,14.1 22.35,14.1 arc90 22.23,13.97 10.54,13.97 9.65,15.24 9.65,20.7 9.73,20.62 IC1.14
PD6  (via drill 0.41)
  Top 0.254: 7.22,13.34 3.43,13.34 J6.3
  Top 0.305: v21.46,25.27 20.8,25.94 IC1.53 | 7.22,13.34 v22.73,13.34
  Bottom 0.305: v21.46,25.27 22.73,24 v22.73,13.34
PD7
  Top 0.254: J6.2 4.7,14.61 4.7,16.76
  Top 0.305: 4.7,16.76 7.87,19.94 7.87,21.97 8.13,22.23 11.3,22.23 11.7,22.62 IC1.10
PE0  (via drill 0.41)
  Top 0.305: MOTOR1DRV.21 18.7,11.46 v17.65,12.45 | v15.11,23.11 14.86,23.12 IC1.9
  Bottom 0.305: v15.11,23.11 16.26,23.11 16.26,13.21 17.27,13.21 v17.65,12.45
PE1  (via drill 0.41)
  Top 0.305: MOTOR1DRV.22 18.03,9.88 18.03,11.05 16.64,12.45 v15.37,12.45 | IC1.8 10.42,23.62 v7.87,26.42
  Bottom 0.305: v15.37,12.45 15.37,13.34 15.75,13.72 15.75,22.1 15.49,22.35 14.72,22.35 13.45,23.49 10.67,23.49 v7.87,26.42
PE2  (via drill 0.41)
  Top 0.305: v9.27,26.04 10.91,24.12 IC1.7 | MOTOR1DRV.17 21.34,9.92 21.34,10.92 20.07,10.92 v20.07,12.57
  Bottom 0.305: v20.07,12.57 20.45,14.48 20.45,18.67 20.96,18.67 20.96,22.73 19.81,24.13 11.18,24.13 v9.27,26.04
PE3  (via drill 0.41)
  Top 0.305: MOTOR1DRV.16 21.95,11.58 v21.59,11.94 | IC1.6 13.43,24.64 11.94,24.64 v9.4,27.18
  Bottom 0.305: v21.59,11.94 21.97,11.94 21.97,18.67 21.59,18.67 21.59,23.37 20.32,24.64 11.56,24.64 11.56,25.02 v9.4,27.18
PF0
  Top 0.254: IC1.28 20.83,17.77 20.83,19.3 22.73,19.3 23.75,18.29 23.75,17.02 24.89,17.02 25.15,17.27 PF0.A
PF1  (via drill 0.41)
  Top 0.305: MOTOR1DRV.23 17.39,10.67 16.51,11.56 v14.61,11.56 | v21.21,16.13 21.3,16.22 IC1.29
  Bottom 0.305: v21.21,16.13 21.21,12.83 20.83,12.45 20.83,11.56 v14.61,11.56
PF2  (via drill 0.41)
  Top 0.305: MOTOR1DRV.15 22.61,9.89 22.61,11.56 22.99,11.94 v23.62,11.94 | v23.62,15.75 22.99,15.75 22.1,15.88 21.8,16.81 IC1.30
  Bottom 0.305: v23.62,11.94 v23.62,15.75
PF3
  Top 0.254: IC1.31 22.3,16.94 22.61,16.38 26.43,16.51 PF3.A
RST  (via drill 0.41)
  Top 0.305: IC1.38 24.67,22.1 26.8,22.1 27.94,20.96 27.94,18.67 28.32,18.29 34.42,18.29 v34.54,18.16 | R3.1 R4.2 34.42,29.21 v34.29,29.34 34.29,31.88 v36.32,33.91
  Bottom 0.305: v36.32,33.91 36.32,35.69 36.2,35.81 36.2,37.85 J2.6 | v34.54,18.16 34.54,28.89 34.29,29.14 v34.29,29.34
TCK  (via drill 0.41)
  Top 0.305: IC1.52 21.3,31.97 21.59,32.26 R5.1 21.97,33.15 v22.61,33.15
  Bottom 0.305: J2.3 26.04,37.85 26.04,35.81 25.27,35.05 24.51,35.05 v22.61,33.15
TDI  (via drill 0.41)
  Top 0.305: IC1.50 22.3,30.43 22.43,30.43 24.51,32.38 24.51,32.51 v25.78,32.51
  Bottom 0.305: v25.78,32.51 30.61,32.51 33.66,34.92 33.66,37.85 J2.5
TDO  (via drill 0.41)
  Top 0.305: IC1.49 22.8,29.28 v25.15,31.62
  Bottom 0.305: J2.4 31.12,37.85 31.12,35.31 30.23,34.42 24.89,34.42 24.51,34.04 24.51,32.38 25.15,31.75 v25.15,31.62
TMS
  Top 0.305: IC1.51 21.8,31.2 21.93,31.2 23.5,32.77 23.5,37.85 J2.2

### Text on the board
tPlace: PD3 | PD2 | PD1 | PD0 | PE5 | PE4 | PB4 | 3.3V | TMS | TCK | TDO | TDI | RST | GND | GND | PB3 | PA0 | PA1 | PA2 | PA3 | PA4 | PA5 | PA6 | PB2 | PB1 | PB0 | PD5 | PD4 | PA7 | PB5 | CANL | 3.3V | CANH | 12V | GND | GND | PD6 | PC5 | PD7 | PC6 | 3.3V | 3.3V | A01 | B01 | A02 | B02
bPlace: TM4C123GH6PM / / Simple DC Motor Control / with TB6612FNG / / Rev 2 / 9 APR 2018